# Altium schematic sheet LeggedBot.SchDoc
size A
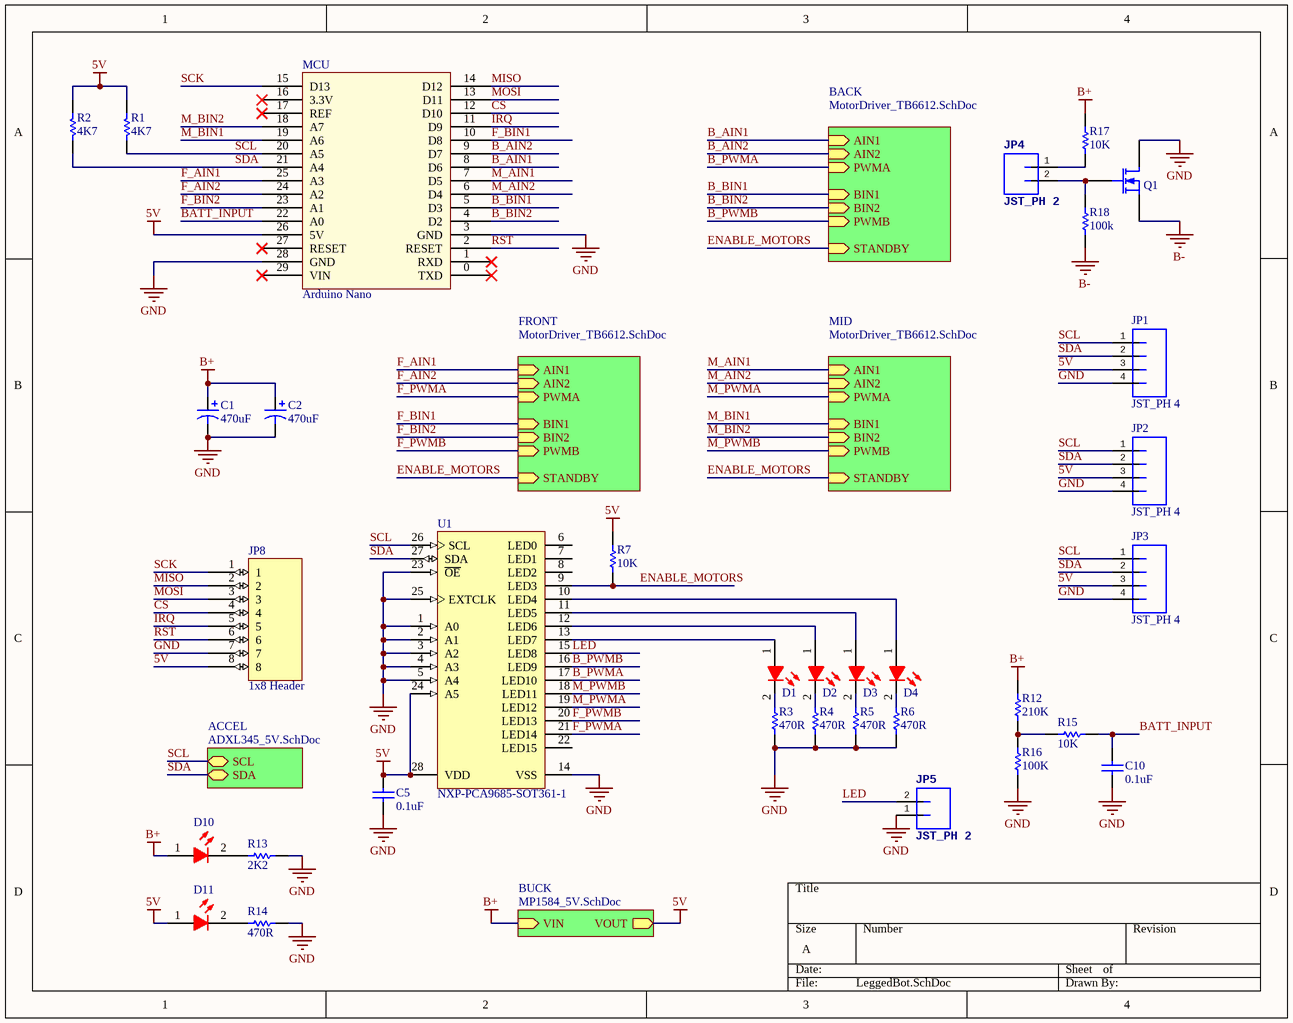
[diagram p0: LeggedBot.SchDoc]

## Parts
C1  470uF  [CAP_10mm]
C2  470uF  [CAP_10mm]
C5  0.1uF  [CAPC0603(1608)100_L]
C10  0.1uF  [CAPC0603(1608)100_L]
D1  TLSU1008A(T04)  [TOSH-0603LED_RED_V]  (value not drawn)
D2  TLSU1008A(T04)  [TOSH-0603LED_RED_V]  (value not drawn)
D3  TLSU1008A(T04)  [TOSH-0603LED_RED_V]  (value not drawn)
D4  TLSU1008A(T04)  [TOSH-0603LED_RED_V]  (value not drawn)
D10  TLSU1008A(T04)  [TOSH-0603LED_RED_V]  (value not drawn)
D11  TLSU1008A(T04)  [TOSH-0603LED_RED_V]  (value not drawn)
JP1  JST_PH 4  [JST-4-PTH-VERT]
JP2  JST_PH 4  [JST-4-PTH-VERT]
JP3  JST_PH 4  [JST-4-PTH-VERT]
JP4  JST_PH 2  [JST-2-PTH-VERT]
JP5  JST_PH 2  [JST-2-PTH-VERT]
JP8  1x8 Header  [Header 8x1 8.5mm]
MCU  Arduino Nano  [Arduino Nano]
Q1  MOSFET-N  [SOIC127P600X175-8N]  (value not drawn)
R1  4K7  [RESC0603(1608)_L]
R2  4K7  [RESC0603(1608)_L]
R3  470R  [RESC0603(1608)_L]
R4  470R  [RESC0603(1608)_L]
R5  470R  [RESC0603(1608)_L]
R6  470R  [RESC0603(1608)_L]
R7  10K  [RESC0603(1608)_L]
R12  210K  [RESC0603(1608)_L]
R13  2K2  [RESC0603(1608)_L]
R14  470R  [RESC0603(1608)_L]
R15  10K  [RESC0603(1608)_L]
R16  100K  [RESC0603(1608)_L]
R17  10K  [RESC0603(1608)_L]
R18  100k  [RESC0603(1608)_L]
U1  NXP-PCA9685-SOT361-1  [TSSOP-28]

## Sub-sheets
ACCEL = ADXL345_5V.SchDoc: SDA, SCL (bidir)
BACK = MotorDriver_TB6612.SchDoc: AIN2 (in), PWMA (in), AIN1 (in), BIN1 (in), BIN2 (in), PWMB (in), STANDBY (in)
BUCK = MP1584_5V.SchDoc: VIN (in), VOUT (out)
FRONT = MotorDriver_TB6612.SchDoc: AIN2 (in), PWMA (in), AIN1 (in), BIN1 (in), BIN2 (in), PWMB (in), STANDBY (in)
MID = MotorDriver_TB6612.SchDoc: AIN2 (in), PWMA (in), AIN1 (in), BIN1 (in), BIN2 (in), PWMB (in), STANDBY (in)

## Nets
5V: C5.2 D11.1(A) JP1.3 JP2.3 JP3.3 JP8.8 MCU.26(5V) R1.2 R2.2 R7.2 U1.24(A5) U1.28(VDD) ; sheet BUCK/VOUT
B+: C1.0 C2.0 D10.1(A) R12.2 R17.2 ; sheet BUCK/VIN
B-: Q1.3(S) R18.1
GND: C1.1 C2.1 C5.1 C10.1 JP1.4 JP2.4 JP3.4 JP5.1 JP8.7 MCU.3(GND) MCU.28(GND) Q1.2(D) R3.1 R4.1 R5.1 R6.1 R13.2 R14.1 R16.1 U1.1(A0) U1.2(A1) U1.3(A2) U1.4(A3) U1.5(A4) U1.14(VSS) U1.23(~{OE}) U1.25(EXTCLK)
B_AIN1: MCU.8(D6) ; sheet BACK/AIN1
B_AIN2: MCU.9(D7) ; sheet BACK/AIN2
B_BIN1: MCU.5(D3) ; sheet BACK/BIN1
B_BIN2: MCU.4(D2) ; sheet BACK/BIN2
B_PWMA: U1.17(LED10) ; sheet BACK/PWMA
B_PWMB: U1.16(LED9) ; sheet BACK/PWMB
BATT_INPUT: C10.2 MCU.22(A0) R15.1
CS: JP8.4 MCU.12(D10)
ENABLE_MOTORS: R7.1 U1.9(LED3) ; sheet FRONT/STANDBY, sheet MID/STANDBY, sheet BACK/STANDBY
F_AIN1: MCU.25(A3) ; sheet FRONT/AIN1
F_AIN2: MCU.24(A2) ; sheet FRONT/AIN2
F_BIN1: MCU.10(D8) ; sheet FRONT/BIN1
F_BIN2: MCU.23(A1) ; sheet FRONT/BIN2
F_PWMA: U1.21(LED14) ; sheet FRONT/PWMA
F_PWMB: U1.20(LED13) ; sheet FRONT/PWMB
IRQ: JP8.5 MCU.11(D9)
LED: JP5.2 U1.15(LED8)
M_AIN1: MCU.7(D5) ; sheet MID/AIN1
M_AIN2: MCU.6(D4) ; sheet MID/AIN2
M_BIN1: MCU.19(A6) ; sheet MID/BIN1
M_BIN2: MCU.18(A7) ; sheet MID/BIN2
M_PWMA: U1.19(LED12) ; sheet MID/PWMA
M_PWMB: U1.18(LED11) ; sheet MID/PWMB
MISO: JP8.2 MCU.14(D12)
MOSI: JP8.3 MCU.13(D11)
RST: JP8.6 MCU.2(RESET)
SCK: JP8.1 MCU.15(D13)
SCL: JP1.1 JP2.1 JP3.1 MCU.20(A5) R1.1 U1.26(SCL) ; sheet ACCEL/SCL
SDA: JP1.2 JP2.2 JP3.2 MCU.21(A4) R2.1 U1.27(SDA) ; sheet ACCEL/SDA
NetD1_1: D1.1(A) U1.13(LED7)
NetD1_2: D1.2(K) R3.2
NetD2_1: D2.1(A) U1.12(LED6)
NetD2_2: D2.2(K) R4.2
NetD3_1: D3.1(A) U1.11(LED5)
NetD3_2: D3.2(K) R5.2
NetD4_1: D4.1(A) U1.10(LED4)
NetD4_2: D4.2(K) R6.2
NetD10_2: D10.2(K) R13.1
NetD11_2: D11.2(K) R14.2
NetJP4_1: JP4.1 R17.1
NetJP4_2: JP4.2 Q1.1(G) R18.2
NetR12_1: R12.1 R15.2 R16.2

Not connected (* = marked no-connect by the designer): MCU 0(TXD)* 1(RXD)* 16(3.3V)* 17(REF)* 27(RESET)* 29(VIN)*; U1 6(LED0) 7(LED1) 8(LED2) 22(LED15)

## Library data of the parts
C1 C2 = CAP_10MM_GENERIC: Generic electrolytic capacitor w/ 10mm diameter and 5mm pitch
C5 C10 = CMP-1035-02591-1: CAP 100nF 50V ±5% 0603 (1608 Metric) Thickness 1mm SMD; Tolerance: Â±5%; Case-Metric: 1608; Case-EIA: 0603; Rated Voltage: 50 V; Max Thickness: 1 mm; Technology: SMT; Value: 100nF
D1-D4 D10 D11 = CMP-0444-00001-1: LED, Red 0603 (1608) 63mCd; Manufacturer: Toshiba; Forward Current: 25 mA; Power Dissipation: 60 mW; Packing Type: Reel; Reverse Voltage: 4 V; Mounting Technology: Surface Mount; PackageDescription: 2-Pin SMT LED, 1.6 x 0.8 mm Pitch; ComponentLink1URL: http://www.toshiba-components.com/; ComponentLink1Description: Manufacturer URL; PackageReference: 0603LED_RED; PartNumber: TLSU1008A(T04); ComponentLink2URL: http://www.semicon.toshiba.co.jp/info/docget.jsp?type=datasheet&lang=en&pid=TLSU1008A(T04); ComponentLink2Description: Datasheet; DatasheetVersion: Aug-08; Storage Temperature: -40 to 100 degC
Q1 = MOSFET-N: N-Channel MOSFET; pin to pad: 1>2 2>3 3>1; Published: 8-Jun-2000; LatestRevisionDate: 17-Jul-2002; LatestRevisionNote: Re-released for DXP Platform.; PackageVersion: 1995/1996; PackageReference: E3; Publisher: Altium Limited; PackageDescription: TO, Flat Index; 3 In-Line, Axial Leads; Body Dia. 4.6mm; Lead Dia. 0.5 mm (max)
R1 R2 = CMP-1012-00090-1: 4K7 0.1W 5% 0603 (1608 Metric)  SMD; Case-Metric: 1608; Value: 4700.00 Ohm; Case-EIA: 0603; Tolerance: 5 %; Technology: SMT; Power: 0.1 W
R3-R6 R14 = CMP-1012-00066-1: 470R 0.1W 5% 0603 (1608 Metric)  SMD; Case-Metric: 1608; Case-EIA: 0603; Value: 470.00 Ohm; Tolerance: 5 %; Technology: SMT; Power: 0.1 W
R7 R15 R17 = CMP-1012-00098-1: 10K 0.1W 5% 0603 (1608 Metric)  SMD; Case-EIA: 0603; Value: 10000.00 Ohm; Case-Metric: 1608; Technology: SMT; Tolerance: 5 %; Power: 0.1 W
R12 = CMP-1012-00770-1: 210K 0.1W 1% 0603 (1608 Metric)  SMD; Case-Metric: 1608; Value: 210000.00 Ohm; Case-EIA: 0603; Technology: SMT; Power: 0.1 W; Tolerance: 1 %
R13 = CMP-1012-00082-1: 2K2 0.1W 5% 0603 (1608 Metric)  SMD; Case-Metric: 1608; Value: 2200.00 Ohm; Case-EIA: 0603; Power: 0.1 W; Tolerance: 5 %; Technology: SMT
R16 R18 = CMP-1012-00736-1: 100K 0.1W 1% 0603 (1608 Metric)  SMD; Value: 100000.00 Ohm; Case-Metric: 1608; Case-EIA: 0603; Power: 0.1 W; Tolerance: 1 %; Technology: SMT
JP8 = 1x8 Header: Supplier 1: Arrow; Supplier 2: Arrow; Supplier 3: Digi-Key